# Altium schematic sheet micron_P5.SchDoc
size A; SheetNumber: 5; SheetTotal: 11
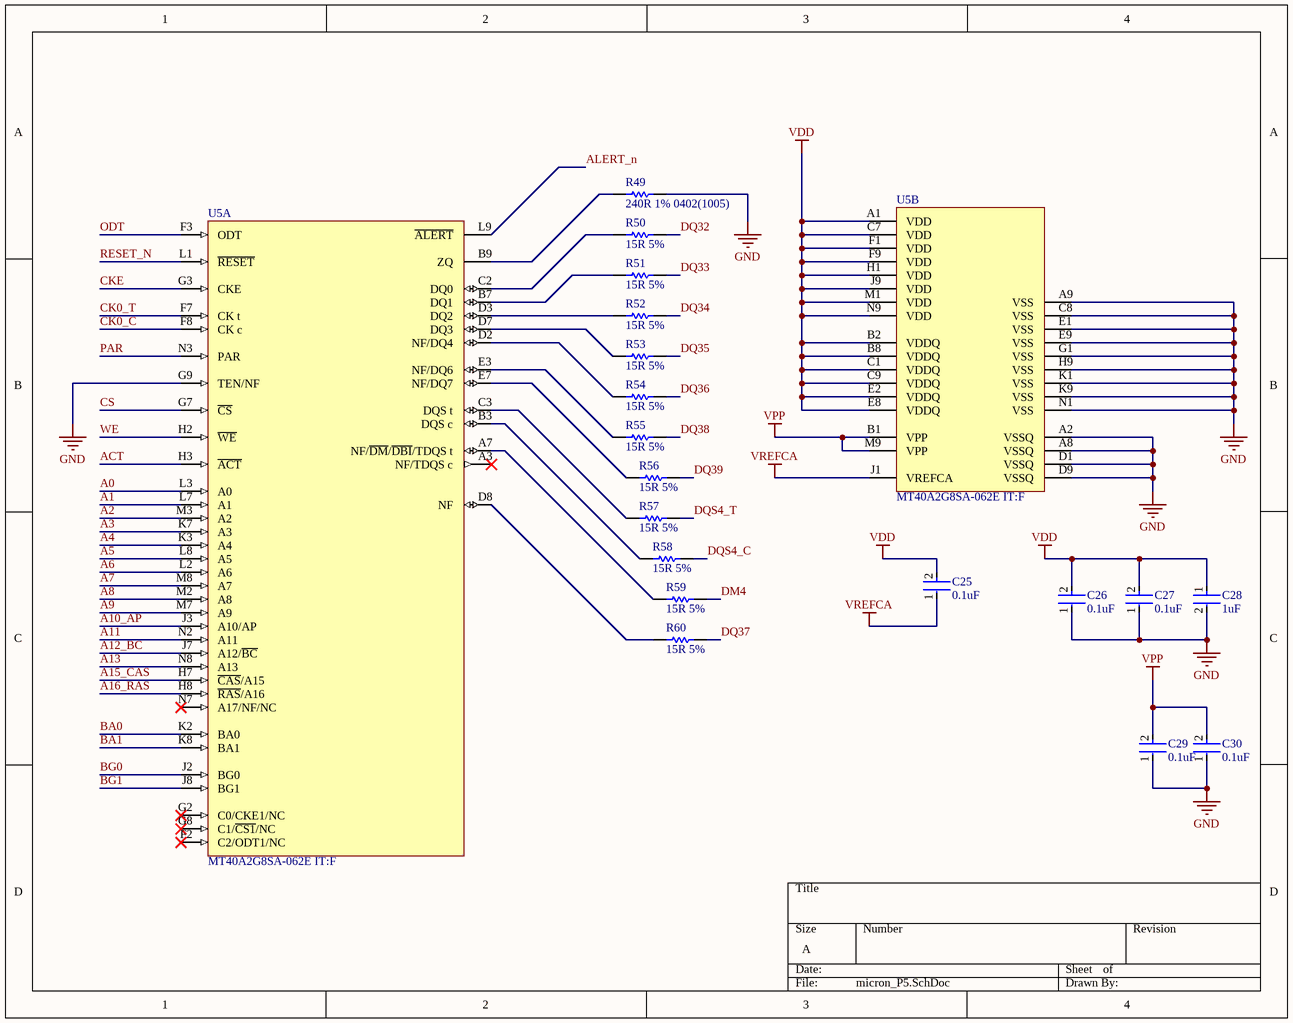
[diagram p0: micron_P5.SchDoc]

## Parts
C25  0.1uF  [FP-GRM15-MFG]
C26  0.1uF  [FP-GRM15-MFG]
C27  0.1uF  [FP-GRM15-MFG]
C28  1uF  [FP-CL511-IPC_C]
C29  0.1uF  [FP-GRM15-MFG]
C30  0.1uF  [FP-GRM15-MFG]
R49  240R 1% 0402(1005)  [RESC0402(1005)_L]
R50  15R 5%  [RESC1005X40X25LL05T10]
R51  15R 5%  [RESC1005X40X25LL05T10]
R52  15R 5%  [RESC1005X40X25LL05T10]
R53  15R 5%  [RESC1005X40X25LL05T10]
R54  15R 5%  [RESC1005X40X25LL05T10]
R55  15R 5%  [RESC1005X40X25LL05T10]
R56  15R 5%  [RESC1005X40X25LL05T10]
R57  15R 5%  [RESC1005X40X25LL05T10]
R58  15R 5%  [RESC1005X40X25LL05T10]
R59  15R 5%  [RESC1005X40X25LL05T10]
R60  15R 5%  [RESC1005X40X25LL05T10]
U5  MT40A2G8SA-062E IT:F  [SA_MFG]  (parts A,B of 2)

## Nets
GND: C26.1 C27.1 C28.2 C29.1 C30.1 R49.2 U5.A2(VSSQ) U5.A8(VSSQ) U5.A9(VSS) U5.C8(VSS) U5.D1(VSSQ) U5.D9(VSSQ) U5.E1(VSS) U5.E9(VSS) U5.G1(VSS) U5.G9(TEN/NF) U5.H9(VSS) U5.K1(VSS) U5.K9(VSS) U5.N1(VSS)
VDD: C25.2 C26.2 C27.2 C28.1 U5.A1(VDD) U5.B2(VDDQ) U5.B8(VDDQ) U5.C1(VDDQ) U5.C7(VDD) U5.C9(VDDQ) U5.E2(VDDQ) U5.E8(VDDQ) U5.F1(VDD) U5.F9(VDD) U5.H1(VDD) U5.J9(VDD) U5.M1(VDD) U5.N9(VDD)
VPP: C29.2 C30.2 U5.B1(VPP) U5.M9(VPP)
VREFCA: C25.1 U5.J1(VREFCA)
A0: U5.L3(A0)
A1: U5.L7(A1)
A2: U5.M3(A2)
A3: U5.K7(A3)
A4: U5.K3(A4)
A5: U5.L8(A5)
A6: U5.L2(A6)
A7: U5.M8(A7)
A8: U5.M2(A8)
A9: U5.M7(A9)
A10_AP: U5.J3(A10/AP)
A11: U5.N2(A11)
A12_BC: U5.J7(A12/~{BC})
A13: U5.N8(A13)
A15_CAS: U5.H7(~{CAS}/A15)
A16_RAS: U5.H8(~{RAS}/A16)
ACT: U5.H3(~{ACT})
ALERT_n: U5.L9(~{ALERT})
BA0: U5.K2(BA0)
BA1: U5.K8(BA1)
BG0: U5.J2(BG0)
BG1: U5.J8(BG1)
CK0_C: U5.F8(CK_c)
CK0_T: U5.F7(CK_t)
CKE: U5.G3(CKE)
CS: U5.G7(~{CS})
DM4: R59.2
DQ32: R50.2
DQ33: R51.2
DQ34: R52.2
DQ35: R53.2
DQ36: R54.2
DQ37: R60.2
DQ38: R55.2
DQ39: R56.2
DQS4_C: R58.2
DQS4_T: R57.2
ODT: U5.F3(ODT)
PAR: U5.N3(PAR)
RESET_N: U5.L1(~{RESET})
WE: U5.H2(~{WE})
NetR49_1: R49.1 U5.B9(ZQ)
NetR50_1: R50.1 U5.C2(DQ0)
NetR51_1: R51.1 U5.B7(DQ1)
NetR52_1: R52.1 U5.D3(DQ2)
NetR53_1: R53.1 U5.D7(DQ3)
NetR54_1: R54.1 U5.D2(NF/DQ4)
NetR55_1: R55.1 U5.E3(NF/DQ6)
NetR56_1: R56.1 U5.E7(NF/DQ7)
NetR57_1: R57.1 U5.C3(DQS_t)
NetR58_1: R58.1 U5.B3(DQS_c)
NetR59_1: R59.1 U5.A7(NF/~{DM}/~{DBI}/TDQS_t)
NetR60_1: R60.1 U5.D8(NF)

Not connected (* = marked no-connect by the designer): U5 A3(NF/TDQS_c)* F2(C2/ODT1/NC)* G2(C0/CKE1/NC)* G8(C1/~{CS1}/NC)* N7(A17/NF/NC)*

## Library data of the parts
C25-C27 C29 C30 = CMP-2100-03641-2: CAP CER 0.1UF 16V X7R 0402; Manufacturer Part Number: GRM155R71C104KA88D; Manufacturer: Murata; Standoff Height: 0mm; Tolerance: 10%; Voltage Rating: 16Vdc; Material: Ceramic; Capacitance: 0.10μF; Value: 0.10μF; RoHS: TRUE; Temperature Characteristic: X7R; Octopart: https://octopart.com/grm155r71c104ka88d-murata-196880; Digikey Description: CAP CER 0.1UF 16V X7R 0402; Device Class L3: Ceramic Capacitors; Height: 0.55mm; ComponentLink2Description: Datasheet; Temperature Range Low: -55°C; Ipc Land Pattern Name: CAPC10050X219; ComponentLink2URL: https://search.murata.co.jp/Ceramy/image/img/A01X/G101/ENG/GRM155R71H471KA01-01A.pdf; Device Class L1: Passive Components; Lead Free: yes; Category: Cap; Package: GRM15; Temperature: -55°C to +125°C; Device Class L2: Capacitors; Temperature Range High: +125°C; Mouser Description: 0402 0.1 uF 16V ±10 % Tolerance X7R SMT Multilayer Ceramic Capacitor
C28 = CMP-13271-001936-1: Cap Ceramic 1uF 10V X5R ±10% SMD 0402 +85°C Paper T/R; Depth: 0.5mm; Case Code (Imperial): 0402; Material: Ceramic; Mount: Surface Mount; Thickness: 0.022inch; Dielectric: X5R; Capacitance: 1uF; Radiation Hardening: No; Case/Package: 0402; Length: 1mm; Tolerance: 10%; Max Operating Temperature: 85°C; Package Quantity: 1; Width: 0.02inch; Voltage Rating: 10V; Contact Plating: Tin; Height: 0.5mm; Min Operating Temperature: -55°C; Case Code (Metric): 1005; Packaging: Tape and Reel
R49 = CMP-1011-00438-1: 240R 0.063W 1% 0402 (1005 Metric)  SMD; Case-Metric: 1005; Case-EIA: 0402; Value: 240.00 Ohm; Power: 0.063 W; Tolerance: 1 %; Technology: SMT
R50-R60 = CMP-2002-07413-1: Manufacturer: Yageo / Phycomp; Part Number: RC0402FR-0715RL
U5 = CMP-00526-125391410-1: DRAMChip DDR4 SDRAM 16Gbit 2Gx8 1.2V 78-Pin FBGA Tray; ComponentLink1URL: http://www.micron.com/; ComponentLink3Description: Manufacturer's Package Drawing; ComponentLink2Description: Datasheet URL; ComponentLink1Description: Manufacturer's Website; ComponentLink3URL: https://www.micron.com/content/dam/micron/global/public/products/customer-service-note/csn33-bga-user-guide.pdf; HelpURL: https://4donline.ihs.com/images/VipMasterIC/IC/MICT/MICT-S-A0014105731/MICT-S-A0014105731-1.pdf?hkey=6D3A4C79FDBF58556ACFDE234799DDF0; ComponentLink2URL: https://4donline.ihs.com/images/VipMasterIC/IC/MICT/MICT-S-A0014105731/MICT-S-A0014105731-1.pdf?hkey=6D3A4C79FDBF58556ACFDE234799DDF0